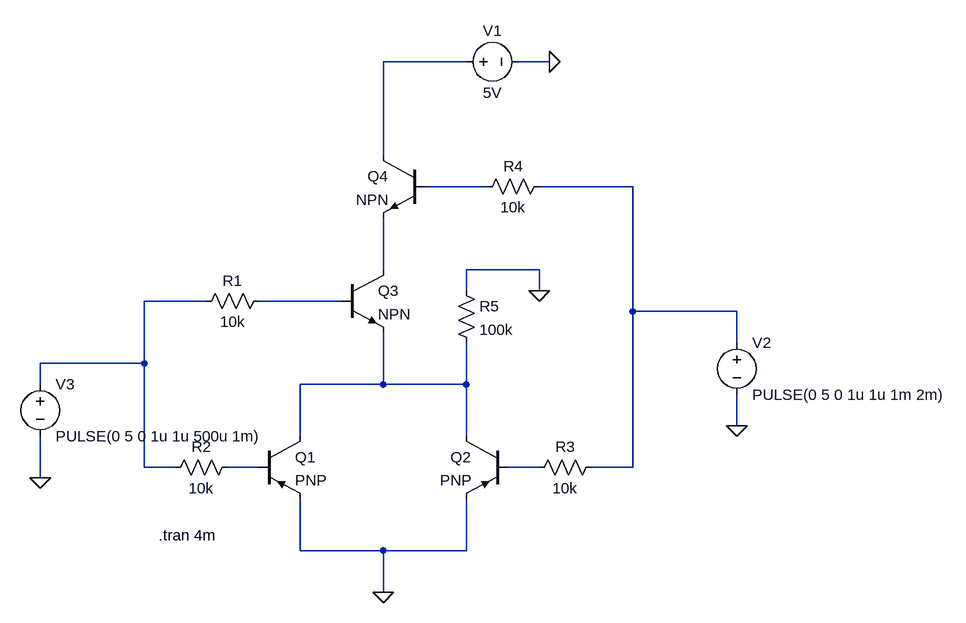
[diagram p0: schematic AndGate.asc]
AndGate.asc, the LTspice schematic file:
Version 4
SHEET 1 964 680
WIRE 224 -192 96 -192
WIRE 352 -192 304 -192
WIRE 96 -48 96 -192
WIRE 256 0 160 0
WIRE 480 0 336 0
WIRE 96 128 96 48
WIRE 336 128 224 128
WIRE 224 160 224 128
WIRE 336 160 336 128
WIRE -176 176 -272 176
WIRE 32 176 -96 176
WIRE 480 192 480 0
WIRE 640 192 480 192
WIRE 640 240 640 192
WIRE -272 272 -272 176
WIRE -272 272 -432 272
WIRE -432 304 -432 272
WIRE 96 304 96 224
WIRE 96 304 -32 304
WIRE 224 304 224 240
WIRE 224 304 96 304
WIRE 640 368 640 320
WIRE -32 384 -32 304
WIRE 224 384 224 304
WIRE -272 432 -272 272
WIRE -224 432 -272 432
WIRE -96 432 -144 432
WIRE 336 432 288 432
WIRE 480 432 480 192
WIRE 480 432 416 432
WIRE -432 448 -432 384
WIRE -32 560 -32 480
WIRE 96 560 -32 560
WIRE 224 560 224 480
WIRE 224 560 96 560
WIRE 96 624 96 560
FLAG 96 624 0
FLAG 352 -192 0
FLAG -432 448 0
FLAG 640 368 0
FLAG 336 160 0
SYMBOL pnp -96 384 R0
SYMATTR InstName Q1
SYMBOL pnp 288 384 M0
SYMATTR InstName Q2
SYMBOL npn 32 128 R0
SYMATTR InstName Q3
SYMBOL npn 160 -48 M0
SYMATTR InstName Q4
SYMBOL voltage 208 -192 R270
WINDOW 0 32 56 VTop 2
WINDOW 3 -32 56 VBottom 2
WINDOW 123 0 0 Left 0
WINDOW 39 0 0 Left 0
SYMATTR InstName V1
SYMATTR Value 5V
SYMBOL res -80 160 R90
WINDOW 0 0 56 VBottom 2
WINDOW 3 32 56 VTop 2
SYMATTR InstName R1
SYMATTR Value 10k
SYMBOL res -128 416 R90
WINDOW 0 0 56 VBottom 2
WINDOW 3 32 56 VTop 2
SYMATTR InstName R2
SYMATTR Value 10k
SYMBOL res 432 416 R90
WINDOW 0 0 56 VBottom 2
WINDOW 3 32 56 VTop 2
SYMATTR InstName R3
SYMATTR Value 10k
SYMBOL res 352 -16 R90
WINDOW 0 0 56 VBottom 2
WINDOW 3 32 56 VTop 2
SYMATTR InstName R4
SYMATTR Value 10k
SYMBOL voltage 640 224 R0
WINDOW 123 0 0 Left 0
WINDOW 39 0 0 Left 0
SYMATTR InstName V2
SYMATTR Value PULSE(0 5 0 1u 1u 1m 2m)
SYMBOL voltage -432 288 R0
WINDOW 123 0 0 Left 0
WINDOW 39 0 0 Left 0
SYMATTR InstName V3
SYMATTR Value PULSE(0 5 0 1u 1u 500u 1m)
SYMBOL res 208 144 R0
SYMATTR InstName R5
SYMATTR Value 100k
TEXT -250 536 Left 2 !.tran 4m

The netlist it stands for:
* AndGate.asc
Q1 N007 N008 0 0 PNP
Q2 N007 N009 0 0 PNP
Q3 N004 N006 N007 0 NPN
Q4 N001 N002 N004 0 NPN
V1 N001 0 5V
R1 N006 N005 10k
R2 N008 N005 10k
R3 N003 N009 10k
R4 N003 N002 10k
V2 N003 0 PULSE(0 5 0 1u 1u 1m 2m)
V3 N005 0 PULSE(0 5 0 1u 1u 500u 1m)
R5 0 N007 100k
.model NPN NPN
.model PNP PNP
.lib standard.bjt
.tran 4m
.backanno
.end